# Altium schematic sheet TColour2to3.schDoc: LiveDesign Evaluation - Video Windows
size A4; Organization: Altium Limited; Address1: L3, 12a Rodborough Rd; Address2: Frenchs Forest; Address3: NSW; Address4: Australia 2086; DocumentNumber: 2; SheetNumber: 2; SheetTotal: 20
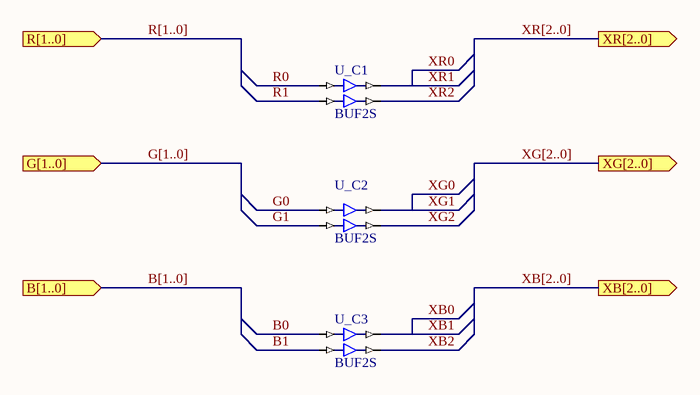
[diagram p0: TColour2to3.schDoc]

## Parts
U_C1  BUF2S
U_C2  BUF2S
U_C3  BUF2S

## Ports
B[1..0] (in), G[1..0] (in), R[1..0] (in), XB[2..0] (out), XG[2..0] (out), XR[2..0] (out)

## Nets
B0: U_C3.I0
B1: U_C3.I1
G0: U_C2.I0
G1: U_C2.I1
R0: U_C1.I0
R1: U_C1.I1
XB0: U_C3.O0  [also labelled XB1]
XB2: U_C3.O1
XG0: U_C2.O0  [also labelled XG1]
XG2: U_C2.O1
XR0: U_C1.O0  [also labelled XR1]
XR2: U_C1.O1

## Buses and harness runs
bus B[1..0] = port B[1..0]
bus G[1..0] = port G[1..0]
bus R[1..0] = port R[1..0]
bus XB[2..0] = port XB[2..0]
bus XG[2..0] = port XG[2..0]
bus XR[2..0] = port XR[2..0]

## Notes on the sheet
- Title
- Size:
- Date:
- A4
- Number:
- Time:
- Revision:
- Sheet
- of
- File:

## Library data of the parts
U_C1-U_C3 = BUF2S: 2-Bit General Purpose (Non-inverting) Buffer, Single Pin Version; Sub Class: BUF; |Port Size: 2; ArchiveName: GENERIC; VHDLIB_SIM: GENERIC_LIB; Published: 29-Jan-2004; Publisher: Altium Limited; Core Revision: 1.00.00; HelpURL: CR0118 FPGA Generic Library Guide.pdf#page=121; Functional Class: Buffer; Port Size: 2; Port Style: Single Pin Version